# Altium schematic sheet LPCB278 - POWER.SchDoc
size A3; Address1: Factory 10; Address2: 9-13 Dingley Avenue, Dandeong, VICTORIA 3175, AUSTRALIA; DocumentNumber: 3; Revision: 1; SheetNumber: 3; SheetTotal: 5; Lockie__PCB_SUB_ASSEMBLY: PCB Sub Component; Lockie__PCB_ASSEMBLY: PCB Assembly; Lockie__LDL: LPCB278; Lockie__PCB_DESCRIPTION: HE Thermal Module
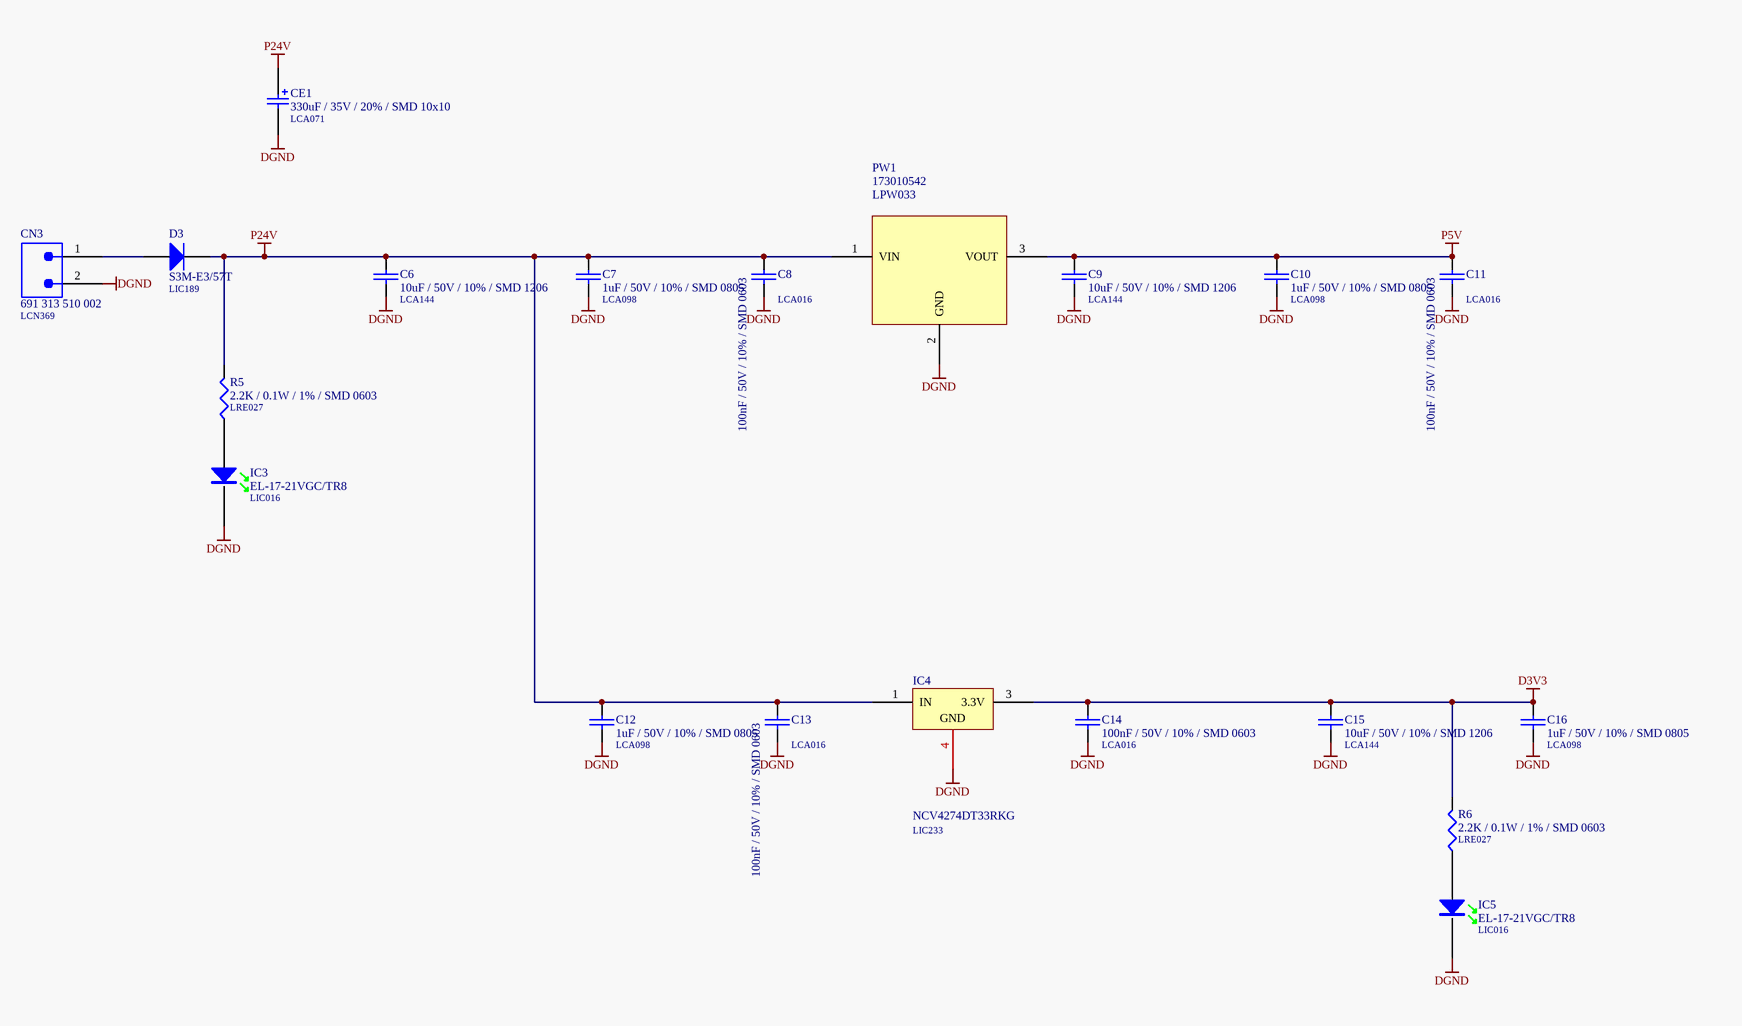
[diagram p0: LPCB278 - POWER.SchDoc]

## Parts
C6  10uF / 50V / 10% / SMD 1206  LDL_NUMBER: LCA144  [LFP043__CC3216-1206]
C7  1uF / 50V / 10% / SMD 0805  LDL_NUMBER: LCA098  [LFP010__CC2012-0805-IPC7351_B]
C8  100nF / 50V / 10% / SMD 0603  LDL_NUMBER: LCA016  [LFP011__CC1608-0603-IPC7351_B]
C9  10uF / 50V / 10% / SMD 1206  LDL_NUMBER: LCA144  [LFP043__CC3216-1206]
C10  1uF / 50V / 10% / SMD 0805  LDL_NUMBER: LCA098  [LFP010__CC2012-0805-IPC7351_B]
C11  100nF / 50V / 10% / SMD 0603  LDL_NUMBER: LCA016  [LFP011__CC1608-0603-IPC7351_B]
C12  1uF / 50V / 10% / SMD 0805  LDL_NUMBER: LCA098  [LFP010__CC2012-0805-IPC7351_B]
C13  100nF / 50V / 10% / SMD 0603  LDL_NUMBER: LCA016  [LFP011__CC1608-0603-IPC7351_B]
C14  100nF / 50V / 10% / SMD 0603  LDL_NUMBER: LCA016  [LFP011__CC1608-0603-IPC7351_B]
C15  10uF / 50V / 10% / SMD 1206  LDL_NUMBER: LCA144  [LFP043__CC3216-1206]
C16  1uF / 50V / 10% / SMD 0805  LDL_NUMBER: LCA098  [LFP010__CC2012-0805-IPC7351_B]
CE1  330uF / 35V / 20% / SMD 10x10  LDL_NUMBER: LCA071  [LFP041__NICHICON_WT_10X10]
CN3  691 313 510 002  LDL_NUMBER: LCN369  [691 313 510 002]
D3  S3M-E3/57T  LDL_NUMBER: LIC189  [LFP040__DO-214AB]
IC3  EL-17-21VGC/TR8  LDL_NUMBER: LIC016  [CR2012-0805-LED]
IC4  NCV4274DT33RKG  LDL_NUMBER: LIC233  [LFP019__369A-13]
IC5  EL-17-21VGC/TR8  LDL_NUMBER: LIC016  [CR2012-0805-LED]
PW1  173010542  LDL_NUMBER: LPW033  [173010542]
R5  2.2K / 0.1W / 1% / SMD 0603  LDL_NUMBER: LRE027  [LFP020__CR1608-0603-IPC7351_B]
R6  2.2K / 0.1W / 1% / SMD 0603  LDL_NUMBER: LRE027  [LFP020__CR1608-0603-IPC7351_B]

## Nets
D3V3: C14.1 C15.1 C16.1 IC4.3(3.3V) R6.2
DGND: C6.2 C7.2 C8.2 C9.2 C10.2 C11.2 C12.2 C13.2 C14.2 C15.2 C16.2 CE1.2 CN3.2 IC3.K IC4.4(GND) IC5.K PW1.2(GND)
P5V: C9.1 C10.1 C11.1 PW1.3(VOUT)
P24V: C6.1 C7.1 C8.1 C12.1 C13.1 CE1.1 D3.1(K) IC4.1(IN) PW1.1(VIN) R5.2
NetCN3_1: CN3.1 D3.2(A)
NetIC3_A: IC3.A R5.1
NetIC5_A: IC5.A R6.1

## Notes on the sheet
- PCB COMPONENT DESCRIPTION
- LDL NUMBER
- Assembly Details
- Size
- Drawing File Name
- Revision
- http://rloop.org
- Scale
- A3
- Sheet Details
- N.T.S
- Sheet:
- Of:

## Library data of the parts
C6 C9 C15 = 10uF / 50V / 10% / SMD 1206: Capacitor, Ceramic Chip, 10uF, 50V, X5R, 10%, SMD 1206 [LCA144]; Value: 10u; FMEDA__OPERATING__TEMP_MAX: 85; FMEDA__OPERATING__TEMP_MIN: -55; FMEDA__OPERATING__TEMP_TYP: 27; FMEDA__OPERATING__VOLTAGE_MAX: 50; FMEDA__OPERATING__VOLTAGE_MIN: 0; FMEDA__CHANNEL: COM; FMEDA__FUNCTION_IN_SYSTEM: *
C7 C10 C12 C16 = 1uF / 50V / 10% / SMD 0805: Capacitor, Ceramic Chip, 1uF, 50V, SMD 0805 [LCA098]; Value: 1u; FMEDA__OPERATING__VOLTAGE_MAX: 3.3; FMEDA__OPERATING__VOLTAGE_MIN: 0; FMEDA__OPERATING__TEMP_MAX: 50; FMEDA__OPERATING__TEMP_MIN: -20; FMEDA__OPERATING__TEMP_TYP: 27; FMEDA__CHANNEL: COM; FMEDA__OPERATING__VOLTAGE_TYP: 3.3; FMEDA__FUNCTION_IN_SYSTEM: *
C8 C11 C13 C14 = 100nF / 50V / 10% / SMD 0603: Capacitor, Ceramic Chip, 100nF (0.1uF), 50V, 5%, SMD 0603 [LCA016]; Value: 100n; FMEDA__OPERATING__VOLTAGE_MIN: 0; FMEDA__OPERATING__VOLTAGE_MAX: 3.3; FMEDA__OPERATING__TEMP_MIN: -20; FMEDA__OPERATING__TEMP_TYP: 27; FMEDA__OPERATING__TEMP_MAX: 50; FMEDA__CHANNEL: COM; FMEDA__FUNCTION_IN_SYSTEM: *; FMEDA__OPERATING__VOLTAGE_TYP: 3.3
CE1 = 330uF / 35V / 20% / SMD 10x10: Capacitor, Aluminum Electrolytic, 330uF, 35V, 20%, SMD (10mm x 10mm) [LCA071]; FMEDA__OPERATING__TEMP_MAX: 50; FMEDA__OPERATING__TEMP_MIN: -20; FMEDA__OPERATING__TEMP_TYP: 27; FMEDA__OPERATING__VOLTAGE_MAX: 0; Value: 330u; FMEDA__CHANNEL: COM; FMEDA__OPERATING__VOLTAGE_MIN: 0; FMEDA__OPERATING__VOLTAGE_TYP: 0; FMEDA__FUNCTION_IN_SYSTEM: *
CN3 = 691 313 510 002: Connector, Pluggable Terminal Block, 5.08mm, 2 Way, PTH; FMEDA__CHANNEL: COM; FMEDA__OPERATING__CURRENT_MAX: 0; FMEDA__OPERATING__TEMP_MAX: 50; FMEDA__OPERATING__TEMP_MIN: -20; FMEDA__OPERATING__TEMP_TYP: 27; FMEDA__OPERATING__VOLTAGE_MAX: 16; FMEDA__OPERATING__VOLTAGE_TYP: 12; FMEDA__FUNCTION_IN_SYSTEM: *; FMEDA__OPERATING__CURRENT_MIN: 0; FMEDA__OPERATING__CURRENT_TYP: 0; FMEDA__OPERATING__VOLTAGE_MIN: 0
D3 = S3M-E3/57T: Diode, General Purpose Rectifier, 3A, 200V, SMD DO-214AB [LIC189]; FMEDA__OPERATING__CURRENT_MAX: 0; FMEDA__OPERATING__TEMP_MAX: 50; FMEDA__OPERATING__TEMP_MIN: -20; FMEDA__OPERATING__TEMP_TYP: 27; FMEDA__CHANNEL: COM; FMEDA__OPERATING__CURRENT_MIN: 0; FMEDA__OPERATING__CURRENT_TYP: 0; FMEDA__OPERATING__VOLTAGE_MAX: 0; FMEDA__OPERATING__VOLTAGE_MIN: 0; FMEDA__OPERATING__VOLTAGE_TYP: 0; FMEDA__FUNCTION_IN_SYSTEM: *
IC3 IC5 = EL-17-21VGC/TR8: LED, SMD, 0805 Green [LIC016]; FMEDA__OPERATING__TEMP_MAX: 50; FMEDA__OPERATING__TEMP_MIN: -20; FMEDA__OPERATING__TEMP_TYP: 27; FMEDA__CHANNEL: COM; FMEDA__FUNCTION_IN_SYSTEM: *
IC4 = NCV4274DT33RKG: IC, Voltage Regulator, 400mA, 3.3V LDO, SMD DPAK [LIC233]; FMEDA__OPERATING__OUTPUT_CURRENT_MIN: 0; FMEDA__OPERATING__TEMP_MAX: 50; FMEDA__OPERATING__TEMP_MIN: -20; FMEDA__OPERATING__TEMP_TYP: 27; VALUE: 0; Note: Obey Thermal Design Rules; FMEDA__CHANNEL: COM; FMEDA__OPERATING__OUTPUT_CURRENT_TYP: 0; FMEDA__OPERATING__VOLTAGE_MAX: 0; FMEDA__OPERATING__VOLTAGE_MIN: 0; FMEDA__OPERATING__VOLTAGE_TYP: 0; FMEDA__FUNCTION_IN_SYSTEM: *
R5 R6 = 2.2K / 0.1W / 1% / SMD 0603: Resistor, Ceramic Chip, 2.2K, 0.1W, 1%, SMD 0603 [LRE027]; FMEDA__OPERATING__VOLTAGE_MIN: 0; FMEDA__OPERATING__TEMP_MIN: -20; FMEDA__OPERATING__TEMP_TYP: 27; FMEDA__OPERATING__TEMP_MAX: 50; FMEDA__CHANNEL: COM; VALUE: 2.2K; FMEDA__OPERATING__VOLTAGE_MAX: 0; FMEDA__OPERATING__POWER_MIN: 0; FMEDA__OPERATING__POWER_MAX: 0; FMEDA__FUNCTION_IN_SYSTEM: *; FMEDA__OPERATING__VOLTAGE_TYP: 0